# EAGLE design SDR1806 (EAGLE 7.3.0)
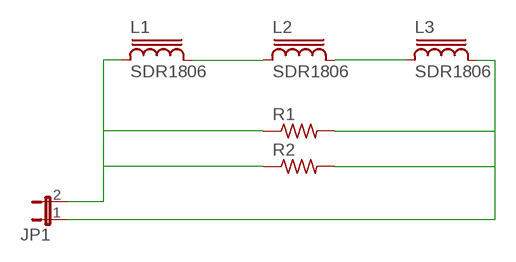
[diagram p0: schematic, sheet 1]

## Parts
JP1  JP1E  [JP1]
L1  SDR1806  [SDR1806]
L2  SDR1806  [SDR1806]
L3  SDR1806  [SDR1806]
R1  R-US_R0603  [R0603]
R2  R-US_R0603  [R0603]

## Nets
N$1: L1.2 L2.1
N$2: L2.2 L3.1
N$3: JP1.2 L1.1 R1.1 R2.1
N$4: JP1.1 L3.2 R1.2 R2.2

## Library data of the parts
JP1 = jumper:JP1E: JUMPER
L1-L3 = SDR1806:SDR1806: POWER INDUCTOR
R1 R2 = rcl:R-US_: RESISTOR, American symbol

## Board
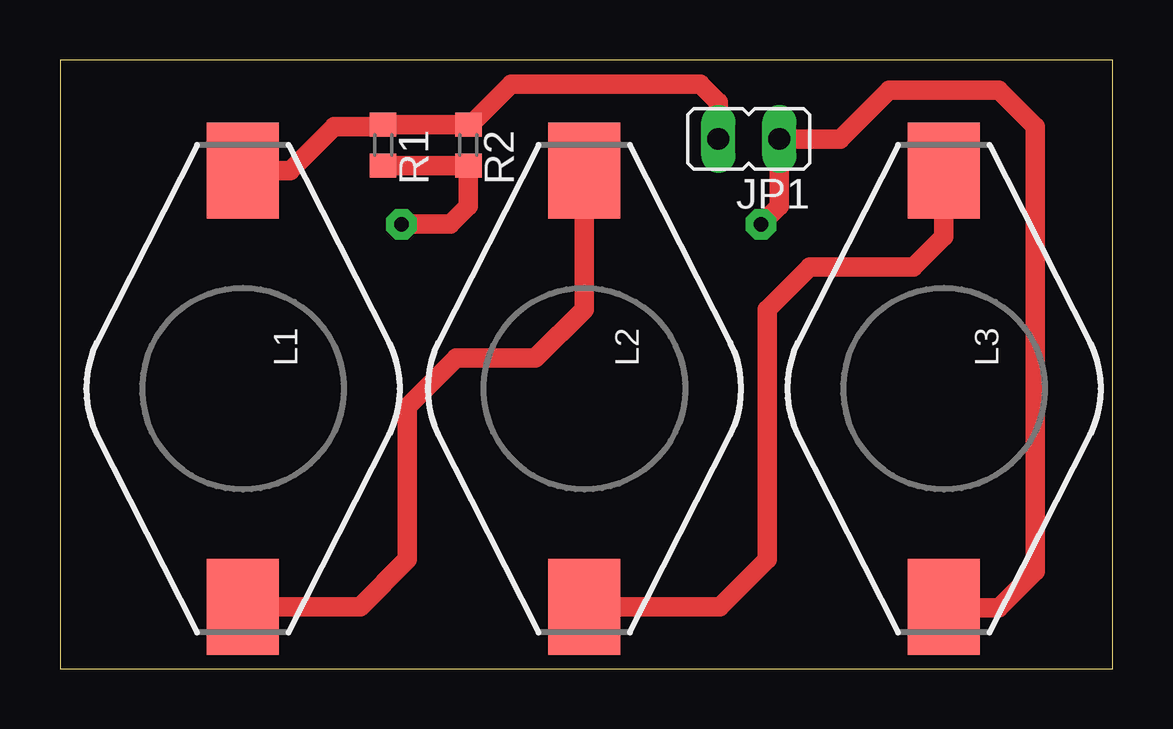
[diagram p1: board, top side]
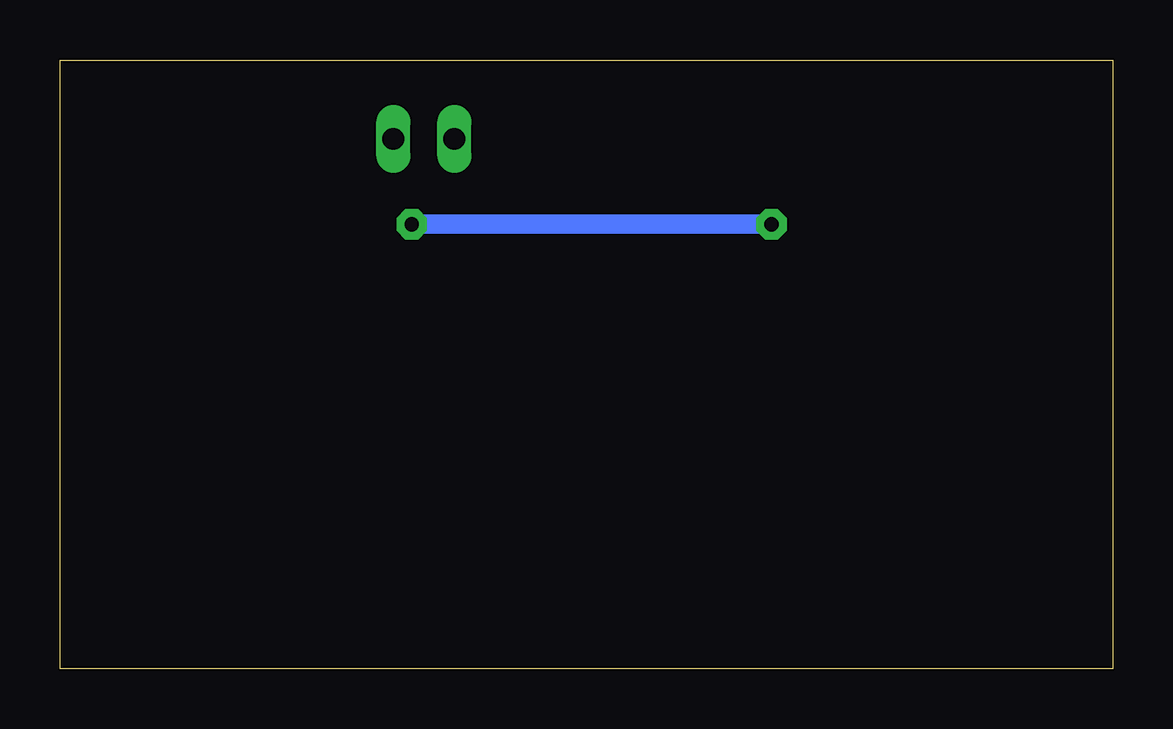
[diagram p2: board, bottom side, seen from below]

Size 43.87 x 25.39 mm. Coordinates in mm from the lower left corner, seen from the top.
Outline: 0,0 43.87,0 43.87,25.39 0,25.39 0,0
Copper layers (1*16): Top 0.035mm / dielectric 1.5mm / Bottom 0.035mm
Design rules "default": minimum track width 10mil, minimum drill 24mil, track to track 8mil, track to pad 8mil, pad to pad 8mil, via to via 8mil, smd to smd 8mil, copper to edge 40mil, drill to drill 8mil, minimum pad ring 10mil, minimum via ring 8mil, stop-mask expansion 4mil, vias tented up to drill 0mil, thermal gap 10mil

### Footprints (pad centres in the part's own frame; a part is rotated, then mirrored left to right if it is on the bottom)
JP1 = drill 0.914 long: 1 0,-1.27; 2 0,1.27
SDR1806 = smd 4 x 3: 1 -9.09,0; 2 9.09,0
R0603 = smd 1 x 1.1: 1 -0.85,0; 2 0.85,0

### Placement (x,y rotation side)
JP1  28.7,22.1 90 top
L1  7.62,11.68 270 top
L2  21.84,11.68 270 top
L3  36.83,11.68 270 top
R1  13.46,21.84 270 top
R2  17.02,21.84 270 top

### Tracks (layer width: path | path; a pad name or v marks a point on that pad's centre or on a via)
N$1
  Top 0.813: L1.2 12.5,2.59 14.48,4.57 14.48,10.92 16.51,12.95 19.81,12.95 21.84,14.99 L2.1
N$2
  Top 0.813: L2.2 27.49,2.59 29.46,4.57 29.46,14.99 31.24,16.76 35.56,16.76 36.83,18.03 L3.1
N$3
  Top 0.61: 13.37,22.61 R1.1 | R2.1 17.11,22.69
  Top 0.813: L1.1 9.6,20.77 11.43,22.61 13.37,22.61 | R1.1 R2.1 | 17.11,22.69 18.8,24.38 26.67,24.38 27.43,23.62 JP1.2
N$4  (via drill 0.6 pad 1.27)
  Top 0.61: 36.88,2.54 L3.2
  Top 0.813: R1.2 R2.2 17.02,19.3 16.26,18.54 v14.22,18.54 | 36.88,2.54 39.12,2.54 40.64,4.06 40.64,22.61 39.12,24.13 34.54,24.13 32.51,22.1 JP1.1 29.97,19.3 v29.21,18.54
  Bottom 0.813: v14.22,18.54 25.15,18.54 28.45,18.54 v29.21,18.54